# EasyEDA Pro project ProProject_基于CW32单片机的无刷电机控制器_2024-04-30.epro, schematic Schematic1

## Sheets
1 P1: Create Date: 2024-02-22; Page Name: P1; Project Name: 基于CW32单片机的伺服电机控制器; Schematic Name: Schematic1; Update Date: 2024-04-02; Company: 嘉立创EDA; Page Size: A4; Version: V1.0
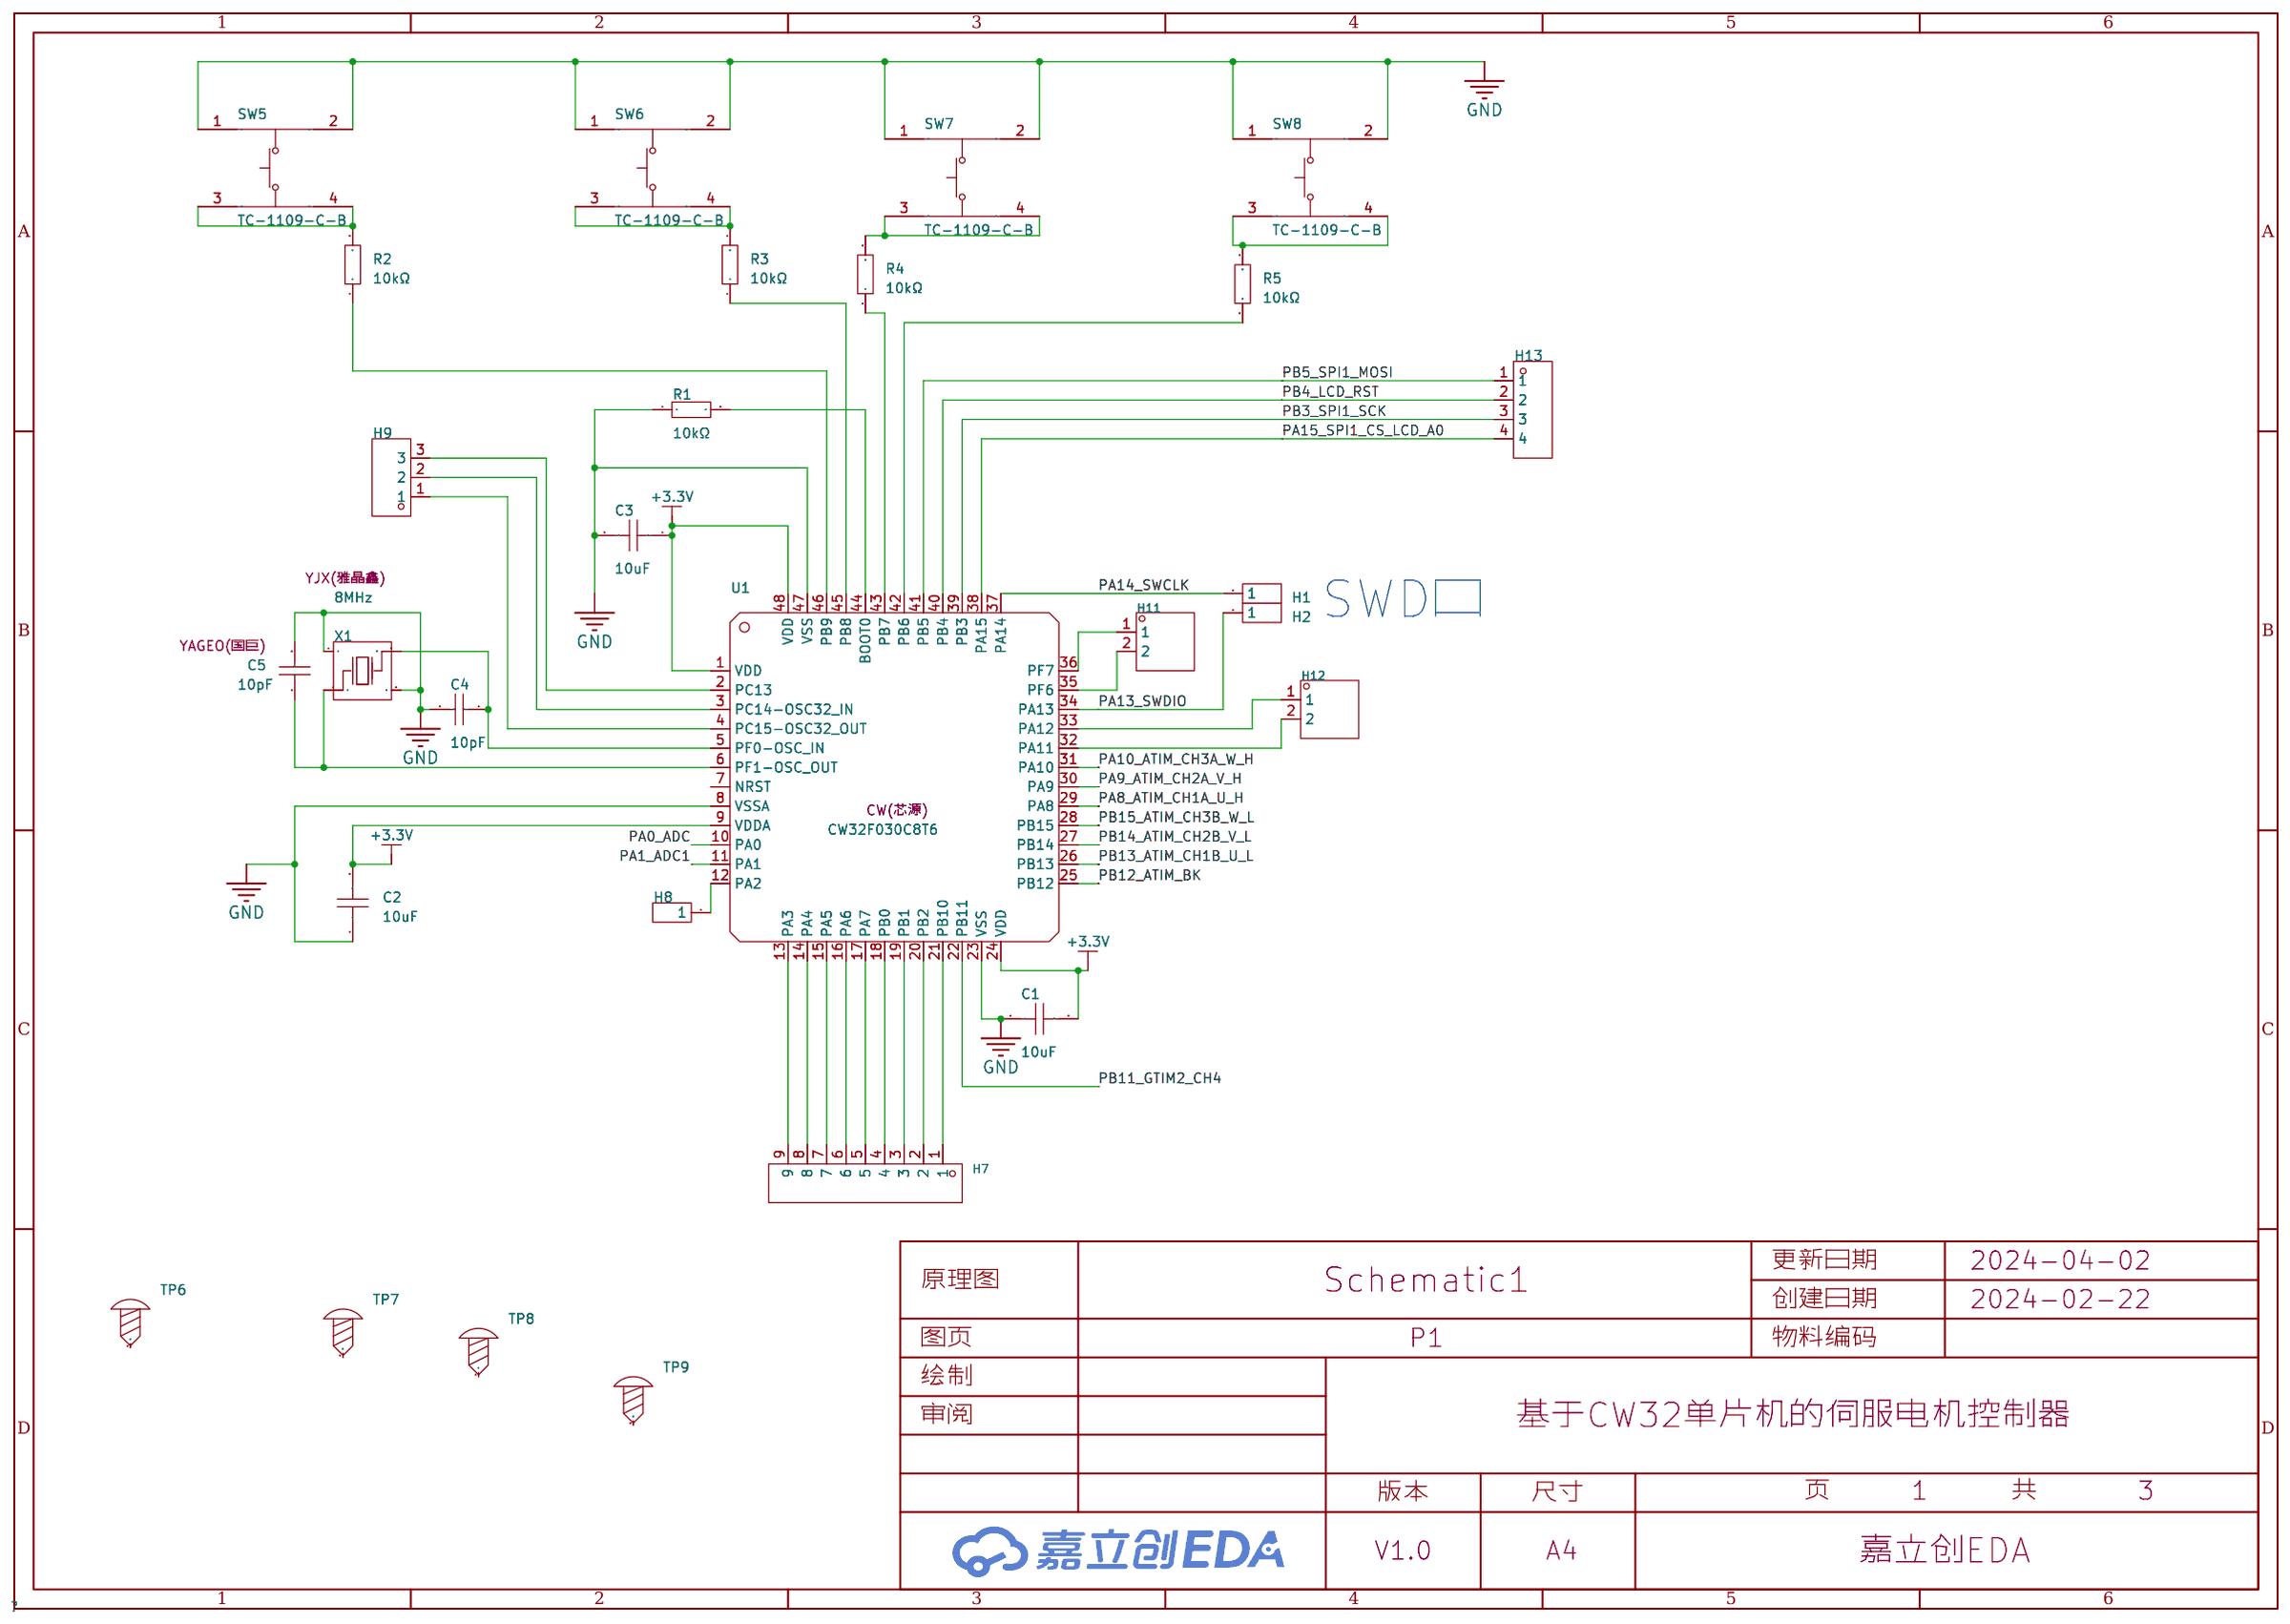
[diagram p0: P1]
2 P2: Create Date: 2024-03-02; Page Name: P2; Update Date: 2024-04-03
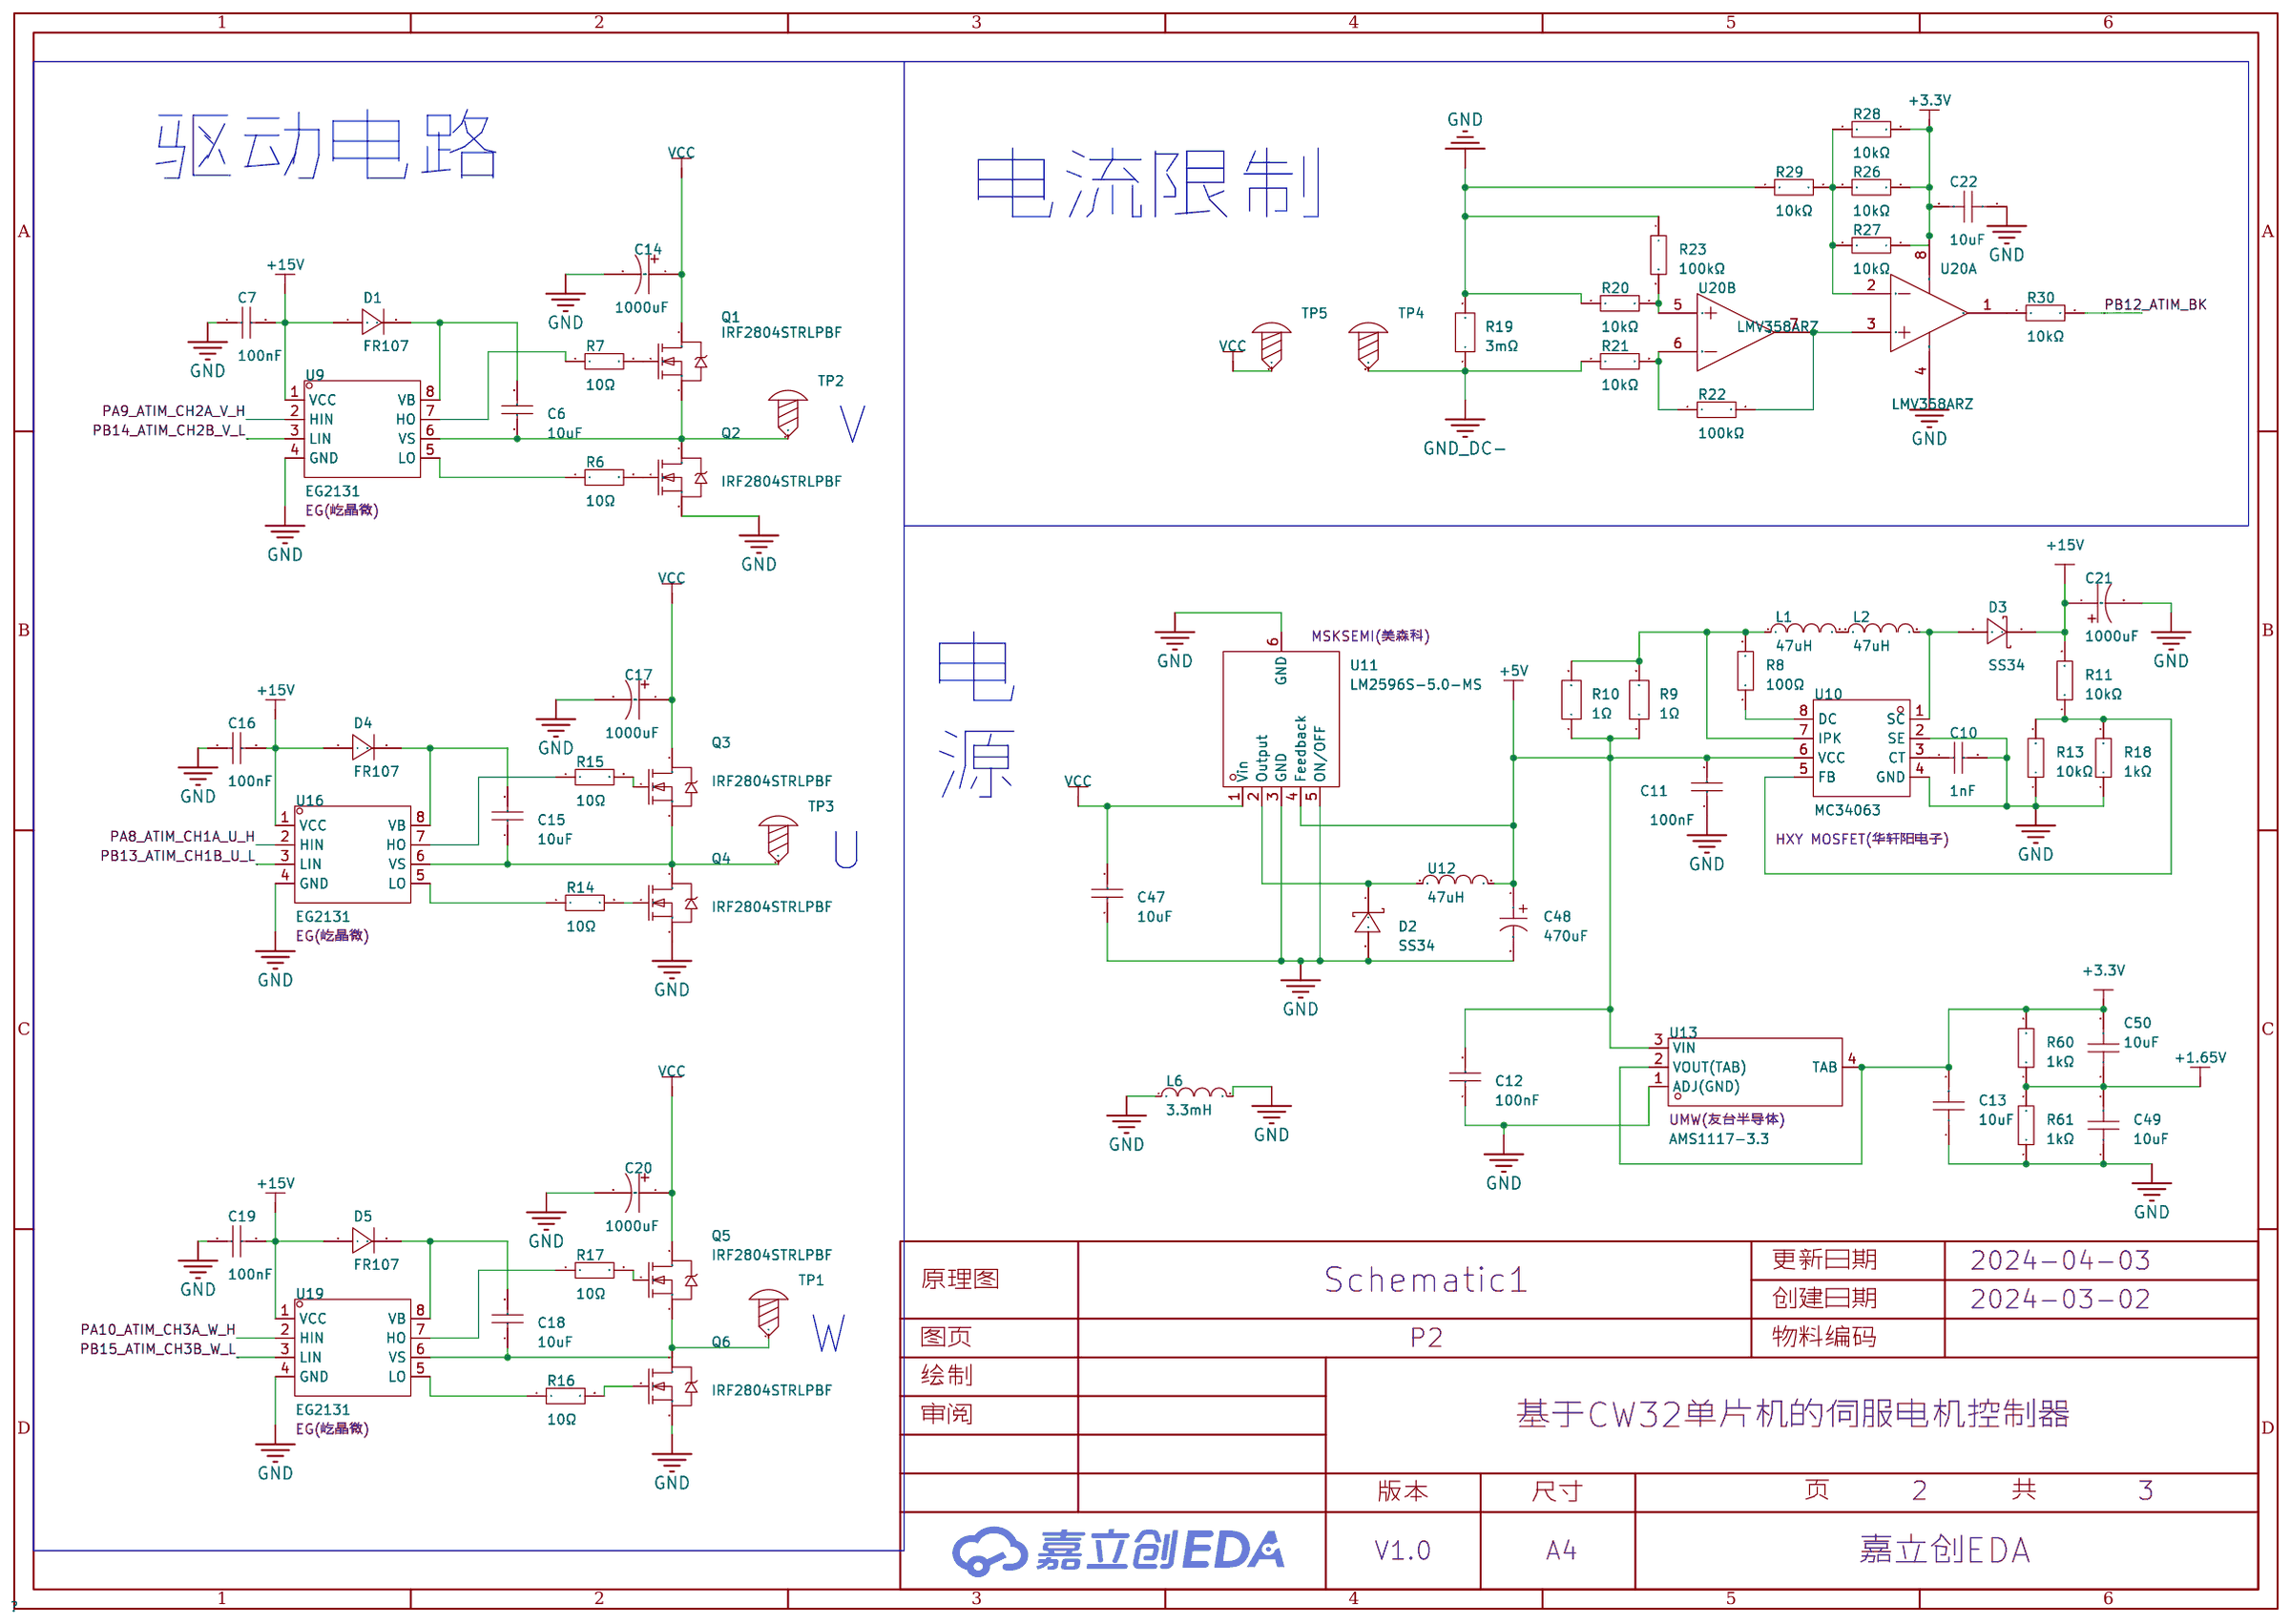
[diagram p1: P2]
3 P3: Create Date: 2024-04-02; Page Name: P3
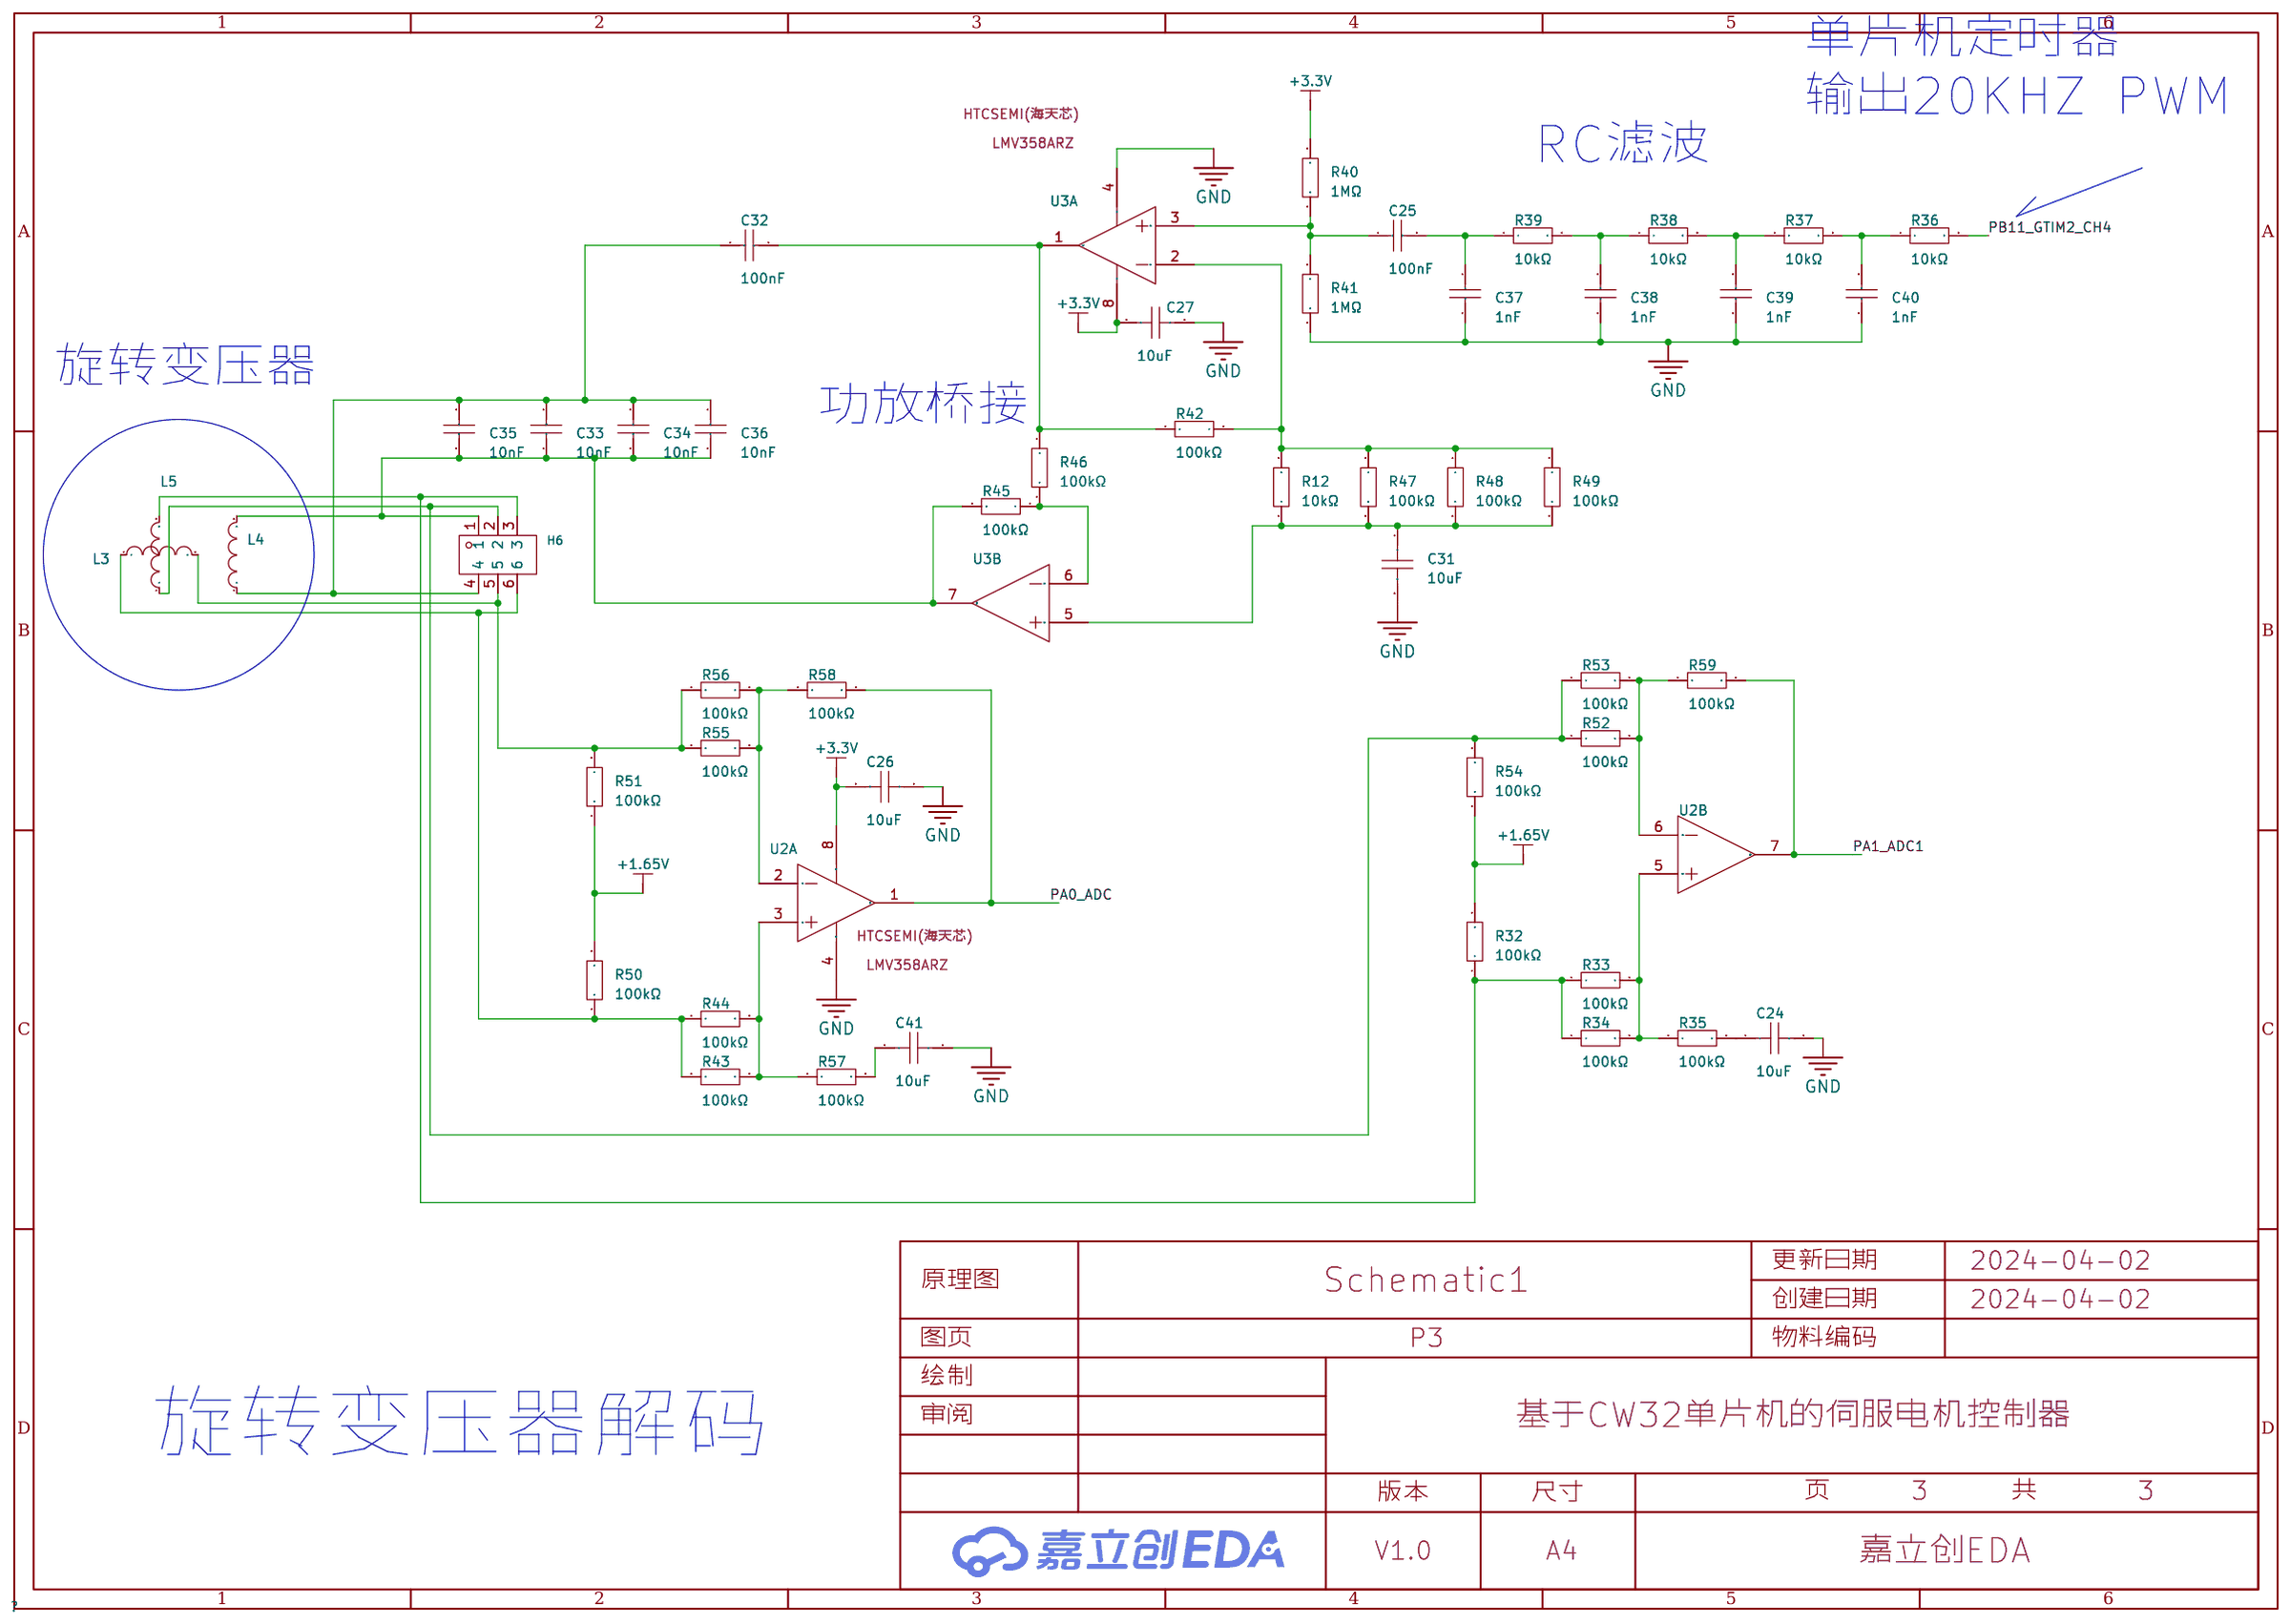
[diagram p2: P3]

## Parts
sheet P1
C1  10uF  [C0603]
C2  10uF  [C0603]
C3  10uF  [C0603]
C4  10pF  [C0603]
C5  10pF  [C0603]
H1  -  [HDR-TH_1P-V-M_XKB_X4611WV-01I-C28D40]
H2  -  [HDR-TH_1P-V-M_XKB_X4611WV-01I-C28D40]
H7  -  [HDR-TH_9P-P2.54-V-M]
H8  -  [HDR-TH_1P-V-M_XKB_X4611WV-01I-C28D40]
H9  -  [HDR-TH_3P-P2.54-V-M]
H11  -  [HDR-TH_2P-P2.54-V-M-1]
H12  -  [HDR-TH_2P-P2.54-V-M-1]
H13  -  [HDR-TH_4P-P2.54-V-M]
R1  10kΩ  [R0603]
R2  10kΩ  [R0603]
R3  10kΩ  [R0603]
R4  10kΩ  [R0603]
R5  10kΩ  [R0603]
SW5  TC-1109-C-B  [KEY-TH_4P-L4.5-W4.5-P3.00-LS5.8]
SW6  TC-1109-C-B  [KEY-TH_4P-L4.5-W4.5-P3.00-LS5.8]
SW7  TC-1109-C-B  [KEY-TH_4P-L4.5-W4.5-P3.00-LS5.8]
SW8  TC-1109-C-B  [KEY-TH_4P-L4.5-W4.5-P3.00-LS5.8]
TP6  -  [M3螺丝]
TP7  -  [M3螺丝]
TP8  -  [M3螺丝]
TP9  -  [M3螺丝]
U1  CW32F030C8T6  [LQFP-48_L7.0-W7.0-P0.50-LS9.0-TL]
X1  8MHz  [OSC-SMD_4P-L3.2-W2.5-BL]
sheet P2
C6  10uF  [C1206]
C7  100nF  [C0603]
C10  1nF  [C0603]
C11  100nF  [C0603]
C12  100nF  [C0603]
C13  10uF  [C0603]
C14  1000uF  [CAP-TH_BD10.0-P5.00-D1.0-FD]
C15  10uF  [C1206]
C16  100nF  [C0603]
C17  1000uF  [CAP-TH_BD10.0-P5.00-D1.0-FD]
C18  10uF  [C1206]
C19  100nF  [C0603]
C20  1000uF  [CAP-TH_BD10.0-P5.00-D1.0-FD]
C21  1000uF  [CAP-TH_BD10.0-P5.00-D1.0-FD]
C22  10uF  [C0603]
C47  10uF  [C1206]
C48  470uF  [CAP-TH_BD10.0-P5.00-D0.6-FD]
C49  10uF  [C0603]
C50  10uF  [C0603]
D1  FR107  [DO-41_BD2.4-L4.7-P8.70-D0.9-FD]
D2  SS34  [SMA_L4.3-W2.6-LS5.2-RD]
D3  SS34  [SMA_L4.3-W2.6-LS5.2-RD]
D4  FR107  [DO-41_BD2.4-L4.7-P8.70-D0.9-FD]
D5  FR107  [DO-41_BD2.4-L4.7-P8.70-D0.9-FD]
L1  47uH  [IND-SMD_L4.5-W4.0_SLF0403]
L2  47uH  [IND-SMD_L4.5-W4.0_SLF0403]
L6  3.3mH  [IND-TH_BD5.0-L10.5-P14.50-D0.6]
Q1  IRF2804STRLPBF  [D2PAK_L10.0-W9.0-P2.54-LS15.0-BR]
Q2  IRF2804STRLPBF  [D2PAK_L10.0-W9.0-P2.54-LS15.0-BR]
Q3  IRF2804STRLPBF  [D2PAK_L10.0-W9.0-P2.54-LS15.0-BR]
Q4  IRF2804STRLPBF  [D2PAK_L10.0-W9.0-P2.54-LS15.0-BR]
Q5  IRF2804STRLPBF  [D2PAK_L10.0-W9.0-P2.54-LS15.0-BR]
Q6  IRF2804STRLPBF  [D2PAK_L10.0-W9.0-P2.54-LS15.0-BR]
R6  10Ω  [R0603]
R7  10Ω  [R0603]
R8  100Ω  [R0603]
R9  1Ω  [R0603]
R10  1Ω  [R0603]
R11  10kΩ  [R0603]
R13  10kΩ  [R0603]
R14  10Ω  [R0603]
R15  10Ω  [R0603]
R16  10Ω  [R0603]
R17  10Ω  [R0603]
R18  1kΩ  [R0603]
R19  3mΩ  [R5930]
R20  10kΩ  [R0603]
R21  10kΩ  [R0603]
R22  100kΩ  [R0603]
R23  100kΩ  [R0603]
R26  10kΩ  [R0603]
R27  10kΩ  [R0603]
R28  10kΩ  [R0603]
R29  10kΩ  [R0603]
R30  10kΩ  [R0603]
R60  1kΩ  [R0603]
R61  1kΩ  [R0603]
TP1  -  [M4螺丝]
TP2  -  [M4螺丝]
TP3  -  [M4螺丝]
TP4  -  [M4螺丝]
TP5  -  [M4螺丝]
U9  EG2131  [SOIC-8_L5.0-W4.0-P1.27-LS6.0-BL]
U10  MC34063  [SOIC-8_L5.0-W4.0-P1.27-LS6.0-BL]
U11  LM2596S-5.0-MS  [TO-263-5_L10.0-W8.4-P1.70-LS15.3-BR]
U12  47uH  [IND-SMD_L7.1-W6.6]
U13  AMS1117-3.3  [SOT-223-4_L6.5-W3.5-P2.30-LS7.0-BR]
U16  EG2131  [SOIC-8_L5.0-W4.0-P1.27-LS6.0-BL]
U19  EG2131  [SOIC-8_L5.0-W4.0-P1.27-LS6.0-BL]
U20  LMV358ARZ  [SOP-8_L4.9-W3.9-P1.27-LS6.0-BL]  (sections 1,2)
sheet P3
C24  10uF  [C0603]
C25  100nF  [C0603]
C26  10uF  [C0603]
C27  10uF  [C0603]
C31  10uF  [C0603]
C32  100nF  [C0603]
C33  10nF  [C0603]
C34  10nF  [C0603]
C35  10nF  [C0603]
C36  10nF  [C0603]
C37  1nF  [C0603]
C38  1nF  [C0603]
C39  1nF  [C0603]
C40  1nF  [C0603]
C41  10uF  [C0603]
H6  PZ254-2-03-Z-8.5  [HDR-TH_6P-P2.54-V-M-R2-C3-S2.54]
L3  10uH  [L1206]
L4  6.3uH  [L1206]
L5  10uH  [L1206]
R12  10kΩ  [R0603]
R32  100kΩ  [R0603]
R33  100kΩ  [R0603]
R34  100kΩ  [R0603]
R35  100kΩ  [R0603]
R36  10kΩ  [R0603]
R37  10kΩ  [R0603]
R38  10kΩ  [R0603]
R39  10kΩ  [R0603]
R40  1MΩ  [R0603]
R41  1MΩ  [R0603]
R42  100kΩ  [R0603]
R43  100kΩ  [R0603]
R44  100kΩ  [R0603]
R45  100kΩ  [R0603]
R46  100kΩ  [R0603]
R47  100kΩ  [R0603]
R48  100kΩ  [R0603]
R49  100kΩ  [R0603]
R50  100kΩ  [R0603]
R51  100kΩ  [R0603]
R52  100kΩ  [R0603]
R53  100kΩ  [R0603]
R54  100kΩ  [R0603]
R55  100kΩ  [R0603]
R56  100kΩ  [R0603]
R57  100kΩ  [R0603]
R58  100kΩ  [R0603]
R59  100kΩ  [R0603]
U2  -  [SOP-8_L4.9-W3.9-P1.27-LS6.0-BL]  (sections 1,2)
U3  -  [SOP-8_L4.9-W3.9-P1.27-LS6.0-BL]  (sections 1,2)

## Library data of the parts
C1-C3 C13 C22 C24 C26 C27 C31 C41 C49 C50 = CL10A106KP8NNNC: 容值:10uF;精度:±10%;额定电压:10V;材质(温度系数):X5R;; LCSC Part Name: 10uF ±10% 10V; Supplier Part: C19702; Manufacturer: SAMSUNG(三星); Supplier Footprint: 0603; JLCPCB Part Class: 基础库; Datasheet: https://atta.szlcsc.com/upload/public/pdf/source/20160218/1457707763339.pdf; Supplier: LCSC; Tolerance: ±10%; Voltage Rated: 10V; Temperature Coefficient: X5R
C4 C5 = CC0603JRNPO9BN100: 容值:10pF;精度:±5%;额定电压:50V;材质(温度系数):NP0;; LCSC Part Name: 10pF ±5% 50V; Supplier Part: C106245; Manufacturer: YAGEO(国巨); Supplier Footprint: 0603; JLCPCB Part Class: 扩展库; Datasheet: https://atta.szlcsc.com/upload/public/pdf/source/20170505/1493957838062.pdf; Supplier: LCSC; Tolerance: ±5%; Voltage Rated: 50V; Temperature Coefficient: NP0
H1 H2 H8 = HDR-M_2.54_1x1P: Supplier Part: C81276; Supplier Footprint: 插件; JLCPCB Part Class: Extended Part
H7 = HDR-M_2.54-1x9P: Supplier Part: C492408; Supplier Footprint: 插件
H9 = HDR-M_2.54_1x3P: Supplier Part: C2937625; Supplier Footprint: 插件
H11 H12 = HDR-M_2.54_1x2P: Supplier Part: C124375; Supplier Footprint: 插件
H13 = HDR-M_2.54_1x4P: Supplier Part: C492403; Supplier Footprint: 插件
R1-R5 R11-R13 R20 R21 R26-R30 R36-R39 = RC0603FR-0710KL: 电阻类型:厚膜电阻;阻值:10kΩ;精度:±1%;功率:100mW;最大工作电压:75V;温度系数:±100ppm/℃;; LCSC Part Name: 厚膜电阻 10kΩ ±1% 100mW; Supplier Part: C98220; Manufacturer: YAGEO(国巨); Supplier Footprint: 0603; JLCPCB Part Class: 扩展库; Datasheet: https://atta.szlcsc.com/upload/public/pdf/source/20180927/C295883_E8D83085EA81BD7DE0B2B681138C15EE.pdf; Supplier: LCSC; Type: 厚膜电阻; Tolerance: ±1%; Power(Watts): 100mW; Overload Voltage (Max): 75V; Temperature Coefficient: ±100ppm/℃; Operating Temperature Range: -55℃~+155℃
SW5-SW8 = TC-1109-C-B: 电路结构:单刀单掷;按钮形状:圆形按钮;作用力:260gf;安装方式:直插;开关长度:4.5mm;开关宽度:4.5mm;开关高度:4.3mm;带支架:不带;触点电流:50mA;额定电压(DC):12V;绝缘电阻:-;带灯:无;机械寿命:10万次;; LCSC Part Name: 4.5*4.5*4.3mm 直插 轻触开关; Supplier Part: C381028; Manufacturer: XKB Connectivity(中国星坤); Supplier Footprint: 插件; JLCPCB Part Class: 扩展库; Datasheet: https://atta.szlcsc.com/upload/public/pdf/source/20200227/C381029_60190E4BA5E8CCEE2F9455ADEE779639.pdf; Supplier: LCSC; Circuit: 单刀单掷; Actuator Style: 圆形按钮; Operating Force: 260gf; Mounting Style: 直插; Switch Length: 4.5mm; Switch Width: 4.5mm; Switch Height: 4.3mm; Strike Gundam: 不带; Contact Current: 50mA; Voltage Rating (DC): 12V; Actuator/Cap Color: 黑色; With Lamp: 无; Pin Style: PC引脚; Mechanical Life: 10万次; Operating Temperature: -30℃~+85℃
TP6-TP9 = M3螺丝: Supplier Footprint: 插件
U1 = CW32F030C8T6_C3019113: CPU内核:ARM-M系列;RAM总容量:8KB;GPIO端口数量:39;工作电压范围:1.65V~5.5V;CPU最大主频:64MHz;程序存储器类型:-;; Supplier Part: C3019113; Manufacturer: CW(芯源); Supplier Footprint: LQFP-48(7x7); JLCPCB Part Class: 扩展库; Datasheet: https://atta.szlcsc.com/upload/public/pdf/source/20220516/D60F5E1023A73FFF550D4A77416DDFBC.pdf; Supplier: LCSC; CPU Core: ARM-M系列; RAM Size: 8KB; GPIO Ports Number: 39; Operating Voltage Range: 1.65V~5.5V; CPU Maximum Speed: 64MHz; Operating Temperature Range: -40℃~+105℃; ADC (Bit): 12bit; 16Bit Timer: 8; UART/USART: 3; I2C: 2; SPI: 2; Internal Comparator: 有; Peripheral/Function: 片载温度传感器；DMA；看门狗；低电压检测；CRC校验; Watchdog: 有; Low-Voltage Detect: 有; Direct Memory Access: 有
X1 = TAXM8M4RDBCCT2T: 晶振类型:贴片晶振;频率:8MHz;常温频差:±10ppm;外接负载电容:10pF;频率稳定度(全温):±15ppm;; LCSC Part Name: 8MHz ±10ppm 10pF; Supplier Part: C400090; Manufacturer: YJX(雅晶鑫); Supplier Footprint: SMD3225-4P; JLCPCB Part Class: 扩展库; Datasheet: https://atta.szlcsc.com/upload/public/pdf/source/20190626/C400090_CF95B89E745AFE4EF2E392EF8AC009D6.pdf; Supplier: LCSC; Crystal Type: 贴片晶振; Normal temperature Frequency Tolerance: ±10ppm; External load capacitor: 10pF; Frequency Stability(Full temperature range): ±15ppm; Equivalent Series Resistance (ESR): 250Ω; Operating Temperature: -40℃~+85℃
C6 C15 C18 C47 = CL31A106KBHNNNE: 容值:10uF;精度:±10%;额定电压:50V;材质(温度系数):X5R;; LCSC Part Name: 10uF ±10% 50V; Supplier Part: C13585; Manufacturer: SAMSUNG(三星); Supplier Footprint: 1206; JLCPCB Part Class: 基础库; Datasheet: https://atta.szlcsc.com/upload/public/pdf/source/20160218/1457707763339.pdf; Supplier: LCSC; Tolerance: ±10%; Voltage Rated: 50V; Temperature Coefficient: X5R
C7 C11 C12 C16 C19 C25 C32 = 0603B104K500NT: 容值:100nF;精度:±10%;额定电压:50V;材质(温度系数):X7R;; LCSC Part Name: 100nF ±10% 50V; Supplier Part: C30926; Manufacturer: FH(风华); Supplier Footprint: 0603; JLCPCB Part Class: 扩展库; Datasheet: https://atta.szlcsc.com/upload/public/pdf/source/20200305/C486355_26A10D38EF8C2A5C37091D0039909270.pdf; Supplier: LCSC; Tolerance: ±10%; Voltage Rated: 50V; Temperature Coefficient: X7R
C10 C37-C40 = CC0603JRNPO9BN102: 容值:1nF;精度:±5%;额定电压:50V;材质(温度系数):NP0;; LCSC Part Name: 1nF ±5% 50V; Supplier Part: C106246; Manufacturer: YAGEO(国巨); Supplier Footprint: 0603; JLCPCB Part Class: 扩展库; Datasheet: https://atta.szlcsc.com/upload/public/pdf/source/20170505/1493957838062.pdf; Supplier: LCSC; Tolerance: ±5%; Voltage Rated: 50V; Temperature Coefficient: NP0
C14 C17 C20 C21 = ERR1VM102G20OT: 容值:1000uF;精度:±20%;额定电压:35V;; LCSC Part Name: 1000uF ±20% 35V; Supplier Part: C398835; Manufacturer: AISHI(艾华集团); Supplier Footprint: 插件,D10xL20mm; JLCPCB Part Class: 扩展库; Datasheet: https://atta.szlcsc.com/upload/public/pdf/source/20190702/C401591_1676EF45BC9A88BD1D6B22BBAE3913C7.pdf; Supplier: LCSC; Tolerance: ±20%; Rated Voltage: 35V; Lead Spacing: 5mm; φD: 10mm; L: 20mm; Lifetime @ Temp: 2000hrs@105℃
C48 = 35V470uF CD110: 容值:470uF;精度:±20%;额定电压:35V;; LCSC Part Name: 470uF ±20% 35V; Supplier Part: C2960394; Manufacturer: HRK(鸿瑞凯电子); Supplier Footprint: 插件,D10xL17mm; JLCPCB Part Class: 扩展库; Datasheet: https://atta.szlcsc.com/upload/public/pdf/source/20220224/D53946E56E2AF613ECCDBE172010D613.pdf; Supplier: LCSC; Tolerance: ±20%; Rated Voltage: 35V; Lead Spacing: 5mm; φD: 10mm; L: 17mm; Operating Temperature: -40℃~+105℃
D1 D4 D5 = FR107_C35253: 二极管配置:-;正向压降(Vf):1.3V@1A;直流反向耐压(Vr):1kV;平均整流电流(Io):1A;反向恢复时间(trr):500ns;; LCSC Part Name: 电压:1kV 电流:1A; Supplier Part: C35253; Manufacturer: MDD; Supplier Footprint: DO-41; JLCPCB Part Class: 扩展库; Datasheet: https://atta.szlcsc.com/upload/public/pdf/source/20230823/95EC475391AED3EACDBE81DA6E12F611.pdf; Supplier: LCSC; Forward Voltage (Vf@If): 1.3V@1A; Reverse Voltage (Vr): 1kV; Average Rectified Current (Io): 1A; Reverse Leakage Current: 5uA@1kV; Reverse Recovery Time (trr): 500ns; Operating Temperature: -65℃~+150℃@(Tj)
D2 D3 = SS34_C8678: 二极管配置:独立式;正向压降(Vf):550mV@3A;直流反向耐压(Vr):40V;平均整流电流(Io):3A;; LCSC Part Name: 电压:40V 电流:3A; Supplier Part: C8678; Manufacturer: MDD; Supplier Footprint: SMA(DO-214AC); JLCPCB Part Class: 基础库; Datasheet: https://atta.szlcsc.com/upload/public/pdf/source/20230314/A80AE34493C69B89E2F4B1712F433538.pdf; Supplier: LCSC; Diode Configuration: 独立式; Forward Voltage (Vf@If): 550mV@3A; Reverse Voltage (Vr): 40V; Average Rectified Current (Io): 3A; Reverse Leakage Current (Ir): 500uA@40V
L1 L2 = SLF0403-470KTT: 电感值:47uH;精度:±10%;额定电流:540mA;; LCSC Part Name: 47uH ±10%; Supplier Part: C182152; Manufacturer: Sunltech(韩国顺磁); Supplier Footprint: SMD; JLCPCB Part Class: 扩展库; Datasheet: https://atta.szlcsc.com/upload/public/pdf/source/20180622/C182201_C2E2778B6752CF513C201C52BBFBA88C.pdf; Supplier: LCSC; Tolerance: ±10%; Rated Current: 540mA; DC Resistance (DCR): 844mΩ
L6 = CKL0510*3.3mH/K-A T: 电感值:3.3mH;精度:±10%;额定电流:62mA;类型:色环电感;Q值:50@0.252MHz;; LCSC Part Name: 色环电感 3.3mH ±10%; Supplier Part: C354678; Manufacturer: CENKER(岑科); Supplier Footprint: 插件,D5xL11mm; JLCPCB Part Class: 扩展库; Datasheet: https://atta.szlcsc.com/upload/public/pdf/source/20190315/C354679_C0281614A754FCB6C690AF872C63A006.pdf; Supplier: LCSC; Tolerance: ±10%; Rated Current: 62mA; DC Resistance: 50Ω; Type: 色环电感; Q @ Frequency: 50@0.252MHz; Frequency - Self Resonant: 700kHz
Q1-Q6 = IRF2804STRLPBF: 类型:N沟道;漏源电压(Vdss):40V;连续漏极电流(Id):75A;功率(Pd):300W;导通电阻(RDS(on)@Vgs,Id):2mΩ@10V,75A;阈值电压(Vgs(th)@Id):4V@250uA;; LCSC Part Name: N沟道 耐压:40V 电流:75A; Supplier Part: C459951; Manufacturer: Infineon(英飞凌); Supplier Footprint: D2PAK; JLCPCB Part Class: 扩展库; Datasheet: https://atta.szlcsc.com/upload/public/pdf/source/20191122/C459951_C5063D70B8F4262A32A22B385B43E8D0.pdf; Supplier: LCSC; Type: N沟道; Drain Source Voltage (Vdss): 40V; Continuous Drain Current (Id): 75A; Power Dissipation (Pd): 300W; Drain Source On Resistance (RDS(on)@Vgs,Id): 2mΩ@10V,75A; Gate Threshold Voltage (Vgs(th)@Id): 4V@250uA; Total Gate Charge (Qg@Vgs): 240nC@10V; Input Capacitance (Ciss@Vds): 6.45nF@25V; Operating Temperature: -55℃~+175℃@(Tj)
R6 R7 R14-R17 = 0603WAF100JT5E: 电阻类型:厚膜电阻;阻值:10Ω;精度:±1%;功率:100mW;最大工作电压:75V;温度系数:±400ppm/℃;; LCSC Part Name: 10Ω ±1% 100mW 厚膜电阻; Supplier Part: C22859; Manufacturer: UNI-ROYAL(厚声); Supplier Footprint: 0603; JLCPCB Part Class: 基础库; Datasheet: https://atta.szlcsc.com/upload/public/pdf/source/20200306/C422600_1E6D84923E4A46A82E41ADD87F860B5C.pdf; Supplier: LCSC; Type: 厚膜电阻; Tolerance: ±1%; Power(Watts): 100mW; Overload Voltage (Max): 75V; Temperature Coefficient: ±400ppm/℃; Operating Temperature Range: -55℃~+155℃
R8 = RC0603FR-07100RL: 电阻类型:厚膜电阻;阻值:100Ω;精度:±1%;功率:100mW;最大工作电压:75V;温度系数:±100ppm/℃;; LCSC Part Name: 厚膜电阻 100Ω ±1% 100mW; Supplier Part: C105588; Manufacturer: YAGEO(国巨); Supplier Footprint: 0603; JLCPCB Part Class: 扩展库; Datasheet: https://atta.szlcsc.com/upload/public/pdf/source/20180316/70C0E2BDAE7FCC62C531A5A58D202EE1.pdf; Supplier: LCSC; Type: 厚膜电阻; Tolerance: ±1%; Power(Watts): 100mW; Overload Voltage (Max): 75V; Temperature Coefficient: ±100ppm/℃; Operating Temperature Range: -55℃~+155℃
R9 R10 = SCR0603F1R: 电阻类型:厚膜电阻;阻值:1Ω;精度:±1%;功率:100mW;最大工作电压:75V;; LCSC Part Name: 1Ω ±1%; Supplier Part: C3016186; Manufacturer: VO(翔胜); Supplier Footprint: 0603; JLCPCB Part Class: 扩展库; Datasheet: https://atta.szlcsc.com/upload/public/pdf/source/20220513/247AF9639BA21CF93567DC289CCC6A22.pdf; Supplier: LCSC; Type: 厚膜电阻; Tolerance: ±1%; Power(Watts): 100mW; Overload Voltage (Max): 75V; Operating Temperature Range: -55℃~+155℃
R18 R60 R61 = RC0603FR-071KL: 电阻类型:厚膜电阻;阻值:1kΩ;精度:±1%;功率:100mW;最大工作电压:75V;温度系数:±100ppm/℃;; LCSC Part Name: 厚膜电阻 1kΩ ±1% 100mW; Supplier Part: C22548; Manufacturer: YAGEO(国巨); Supplier Footprint: 0603; JLCPCB Part Class: 扩展库; Datasheet: https://atta.szlcsc.com/upload/public/pdf/source/20180316/70C0E2BDAE7FCC62C531A5A58D202EE1.pdf; Supplier: LCSC; Type: 厚膜电阻; Tolerance: ±1%; Power(Watts): 100mW; Overload Voltage (Max): 75V; Temperature Coefficient: ±100ppm/℃; Operating Temperature Range: -55℃~+155℃
R19 = EBWS5930F3L00K9L: 电阻类型:采样电阻;阻值:3mΩ;精度:±1%;额定压降:-;功率:7W;温度系数:±100ppm/℃;安装方式:贴片;; LCSC Part Name: 3mΩ ±1% 7W; Supplier Part: C494596; Manufacturer: RESI(开步睿思）; Supplier Footprint: 5930; JLCPCB Part Class: 扩展库; Datasheet: https://atta.szlcsc.com/upload/public/pdf/source/20200428/C494572_1906A236A7F16EA247B6F3B5657545A5.pdf; Supplier: LCSC; Type: 采样电阻; Tolerance: ±1%; Power(Watts): 7W; Temperature Coefficient: ±100ppm/℃; Mounting Sytle: 贴片
R22 R23 R32-R35 R42-R59 = RC0603FR-07100KL: 电阻类型:厚膜电阻;阻值:100kΩ;精度:±1%;功率:100mW;最大工作电压:75V;温度系数:±100ppm/℃;; LCSC Part Name: 厚膜电阻 100kΩ ±1% 100mW; Supplier Part: C14675; Manufacturer: YAGEO(国巨); Supplier Footprint: 0603; JLCPCB Part Class: 扩展库; Datasheet: https://atta.szlcsc.com/upload/public/pdf/source/20140324/1457707028752.pdf; Supplier: LCSC; Type: 厚膜电阻; Tolerance: ±1%; Power(Watts): 100mW; Overload Voltage (Max): 75V; Temperature Coefficient: ±100ppm/℃; Operating Temperature Range: -55℃~+155℃
TP1-TP5 = M4螺丝: Supplier Footprint: 插件
U9 U16 U19 = EG2131: Supplier Part: C193777; Manufacturer: EG(屹晶微); Supplier Footprint: SOIC-8; JLCPCB Part Class: 扩展库; Datasheet: https://atta.szlcsc.com/upload/public/pdf/source/20180528/C193777_0A452F93B99FD4EB2A9D54E9055DABCE.pdf; Supplier: LCSC
U10 = MC34063_C5349988: 功能类型:升降压型;输出类型:可调;输入电压:3V~40V;输出电压:1.25V~40V;输出电流(最大值):1.3A;; Supplier Part: C5349988; Manufacturer: HXY MOSFET(华轩阳电子); Supplier Footprint: SOP-8; JLCPCB Part Class: 扩展库; Datasheet: https://atta.szlcsc.com/upload/public/pdf/source/20231229/D1A87F39F2F1E3F68C55B6C50423EC0B.pdf; Supplier: LCSC; Function: 升降压型; Output Type: 可调; Input Voltage: 3V~40V; Output Voltage: 1.25V~40V; Output Current (Max): 1.3A; Switching Frequency: 100kHz; Operating Temperature: 0℃~+70℃; Number of Outputs: 1; Switch tube (built-in/external): 内置
U11 = LM2596S-5.0-MS: 功能类型:降压型;输出类型:-;输入电压:7V~40V;输出电压:5V;输出电流(最大值):3A;; LCSC Part Name: Vin=7V-40V Vout=5V 3A大电流; Supplier Part: C5174628; Manufacturer: MSKSEMI(美森科); Supplier Footprint: TO-263-5L; JLCPCB Part Class: 扩展库; Datasheet: https://atta.szlcsc.com/upload/public/pdf/source/20221027/4361E163E0CC4DA461A3D8885FDCEFBB.pdf; Supplier: LCSC; Function: 降压型; Input Voltage: 7V~40V; Output Voltage: 5V; Output Current (Max): 3A; Switching Frequency: 150kHz; Synchronous Rectification: 否; Number of Outputs: 1; Topology: 降压式; Switch tube (built-in/external): 内置
U12 = APH0630T470M: 电感值:47uH;精度:±20%;额定电流:1.25A;饱和电流(Isat):1.66A;类型:一体成型电感;; LCSC Part Name: 47uH ±20% 1.66A; Supplier Part: C5349685; Manufacturer: APV(爱普微); Supplier Footprint: SMD,7x6.6mm; JLCPCB Part Class: 扩展库; Datasheet: https://atta.szlcsc.com/upload/public/pdf/source/20230920/8DF4F91CA8787177DE496A10F73889DA.pdf; Supplier: LCSC; Tolerance: ±20%; Rated Current: 1.25A; Saturation Current (Isat): 1.66A; DC Resistance (DCR): 385mΩ; Type: 一体成型电感
U13 = AMS1117-3.3_C347222: 输出类型:固定;最大输入电压:12V;输出电压:3.3V;最大输出电流:1A;电源纹波抑制比(PSRR):60dB@(120Hz);输出极性:正极;; LCSC Part Name: 输出:3.3V 电流:1A 耐压:12V; Supplier Part: C347222; Manufacturer: UMW(友台半导体); Supplier Footprint: SOT-223; JLCPCB Part Class: 扩展库; Datasheet: https://atta.szlcsc.com/upload/public/pdf/source/20231109/155D79A26D9DB04352555A58D5969DC8.pdf; Supplier: LCSC; Output Type: 固定; Maximum Input Voltage: 12V; Output Voltage: 3.3V; MAX Output Current: 1A; Power Supply Rejection Ratio (PSRR): 60dB@(120Hz); Dropout Voltage: 1.3V@(1A); Output Polarity: 正极; Number of Outputs: 1
U2 U3 U20 = LMV358ARZ: 放大器数:双路;; Supplier Part: C2928823; Manufacturer: HTCSEMI(海天芯); Supplier Footprint: SOP-8; JLCPCB Part Class: 扩展库; Datasheet: https://atta.szlcsc.com/upload/public/pdf/source/20220114/2D4B849A76DE33264688A93B3A90A0F8.pdf; Supplier: LCSC; Number of Circuits: 双路
C33-C36 = CC0603KRX7R9BB103: 容值:10nF;精度:±10%;额定电压:50V;材质(温度系数):X7R;; LCSC Part Name: 10nF ±10% 50V; Supplier Part: C100042; Manufacturer: YAGEO(国巨); Supplier Footprint: 0603; JLCPCB Part Class: 扩展库; Datasheet: https://atta.szlcsc.com/upload/public/pdf/source/20181008/C309510_22F155564471FAF6A489F7D68F34234E.pdf; Supplier: LCSC; Tolerance: ±10%; Voltage Rated: 50V; Temperature Coefficient: X7R
H6 = PZ254-2-03-Z-8.5_C2894964: 排数:双排;总PIN位数:6;间距:2.54mm;插针结构:2x3P;行距:2.54mm;安装类型:直插;圆针/方针:方针;额定电流:3A;额定电压:-;配合针长度:6mm;塑高:2.5mm;端接针长度:3mm;触头材质:-;工作温度范围:-40℃~+105℃;颜色:黑色;; Supplier: LCSC; Supplier Part: C2894964; Manufacturer: HCTL(华灿天禄); JLCPCB Part Class: 扩展库; LCSC Part Name: 2.54mm 2x3P 直插 方针; Supplier Footprint: 直插,P=2.54mm; Number of Rows: 双排; Number of Pins: 6; Pitch: 2.54mm; Pin Structure: 2x3P; Row Spacing: 2.54mm; Mounting Type: 直插; Circluar Pins/Square Pins: 方针; Current Rating (Max): 3A; Length of Mating Pin: 6mm; Insulation Height: 2.5mm; Length of End Connection Pin: 3mm; Operating Temperature Range: -40℃~+105℃; Color: 黑色
L3-L5 = L_1206
R40 R41 = 0603WAF1004T5E: 电阻类型:厚膜电阻;阻值:1MΩ;精度:±1%;功率:100mW;; LCSC Part Name: 1MΩ±1%100mW; Supplier Part: C22935; Manufacturer: UNI-ROYAL(厚声); Supplier Footprint: 0603; JLCPCB Part Class: BasicPart; Datasheet: https://atta.szlcsc.com/upload/public/pdf/source/20200306/C422600_1E6D84923E4A46A82E41ADD87F860B5C.pdf; Supplier: LCSC; Type: 厚膜电阻; Tolerance: ±1%; Power(Watts): 100mW; Temperature Coefficient: ±100ppm/℃; Overload Voltage (Max): 75V; Operating Temperature Range: -55℃~+155℃

## Nets
+1.65V: C49.2 C50.1 R32.2 R50.2 R51.1 R54.1 R60.1 R61.2
+3.3V: C1.2 C2.2 C3.1 C13.2 C22.2 C26.2 C27.2 C50.2 R26.2 R27.2 R28.2 R40.2 R60.2 U1.1(VDD) U1.9(VDDA) U1.24(VDD) U1.48(VDD) U2.8(VCC) U3.8(VCC) U13.2(VOUT(TAB)) U13.4(TAB) U20.8(VCC)
+5V: C11.2 C12.2 C48.1 R9.1 R10.1 U10.6(VCC) U11.4(Feedback) U12.2 U13.3(VIN)
+15V: C7.2 C16.2 C19.2 C21.1 D1.1(A) D3.1(K) D4.1(A) D5.1(A) R11.2 U9.1(VCC) U16.1(VCC) U19.1(VCC)
GND: C1.1 C2.1 C3.2 C4.1 C5.2 C7.1 C10.2 C11.1 C12.1 C13.1 C14.2 C16.1 C17.2 C19.1 C20.2 C21.2 C22.1 C24.2 C26.1 C27.1 C31.2 C37.1 C38.1 C39.1 C40.1 C41.2 C47.1 C48.2 C49.1 D2.2(A) L6.1 L6.2 Q2.3(S) Q4.3(S) Q6.3(S) R1.1 R13.1 R18.1 R19.2 R20.1 R23.1 R29.1 R41.1 R61.1 SW5.1 SW5.2 SW6.1 SW6.2 SW7.1 SW7.2 SW8.1 SW8.2 U1.8(VSSA) U1.23(VSS) U1.47(VSS) U2.4(GND) U3.4(GND) U9.4(GND) U10.2(SE) U10.4(GND) U11.3(GND) U11.5(ON/OFF) U11.6(GND) U13.1(ADJ(GND)) U16.4(GND) U19.4(GND) U20.4(GND) X1.2 X1.4
GND_DC-: R19.1 R21.1 TP4.1
VCC: C14.1 C17.1 C20.1 C47.2 Q1.2(D) Q3.2(D) Q5.2(D) TP5.1 U11.1(Vin)
PA0_ADC: R58.2 U1.10(PA0) U2.1(OUT)
PA1_ADC1: R59.2 U1.11(PA1) U2.7(OUT2)
PA8_ATIM_CH1A_U_H: U1.29(PA8) U16.2(HIN)
PA9_ATIM_CH2A_V_H: U1.30(PA9) U9.2(HIN)
PA10_ATIM_CH3A_W_H: U1.31(PA10) U19.2(HIN)
PA13_SWDIO: H2.1 U1.34(PA13)
PA14_SWCLK: H1.1 U1.37(PA14)
PA15_SPI1_CS_LCD_A0: H13.4 U1.38(PA15)
PB3_SPI1_SCK: H13.3 U1.39(PB3)
PB4_LCD_RST: H13.2 U1.40(PB4)
PB5_SPI1_MOSI: H13.1 U1.41(PB5)
PB11_GTIM2_CH4: R36.2 U1.22(PB11)
PB12_ATIM_BK: R30.2 U1.25(PB12)
PB13_ATIM_CH1B_U_L: U1.26(PB13) U16.3(LIN)
PB14_ATIM_CH2B_V_L: U1.27(PB14) U9.3(LIN)
PB15_ATIM_CH3B_W_L: U1.28(PB15) U19.3(LIN)
$1N1046: C4.2 U1.5(PF0-OSC_IN) X1.3
$1N1253: C5.1 U1.6(PF1-OSC_OUT) X1.1
$1N1416: R1.2 U1.44(BOOT0)
$1N1868: R2.1 U1.46(PB9)
$1N1878: R3.1 U1.45(PB8)
$1N1882: R4.1 U1.43(PB7)
$1N1886: R5.1 U1.42(PB6)
$1N6202: H7.1 U1.21(PB10)
$1N6205: H7.2 U1.20(PB2)
$1N6208: H7.3 U1.19(PB1)
$1N6214: H7.4 U1.18(PB0)
$1N6221: H7.5 U1.17(PA7)
$1N6224: H7.6 U1.16(PA6)
$1N6227: H7.7 U1.15(PA5)
$1N6233: H7.8 U1.14(PA4)
$1N6248: H7.9 U1.13(PA3)
$1N6274: H8.1 U1.12(PA2)
$1N9606: R3.2 SW6.3 SW6.4
$1N9611: R2.2 SW5.3 SW5.4
$1N9618: R4.2 SW7.3 SW7.4
$1N9625: R5.2 SW8.3 SW8.4
$2N841: R6.1 U9.5(LO)
$2N1882: D2.1(K) U11.2(Output) U12.1
$2N2223: R8.1 U10.8(DC)
$2N2340: L1.2 L2.1
$2N2437: C10.1 U10.3(CT)
$2N2721: R11.1 R13.2 R18.2 U10.5(FB)
$2N2790: D3.2(A) L2.2 U10.1(SC)
$2N6462: Q3.1(G) R15.2
$2N6470: R14.1 U16.5(LO)
$2N6902: Q6.1(G) R16.2
$2N6903: Q5.1(G) R17.2
$2N6911: R16.1 U19.5(LO)
$2N7060: C6.1 Q1.3(S) Q2.2(D) TP2.1 U9.6(VS)
$2N7066: C15.1 Q3.3(S) Q4.2(D) TP3.1 U16.6(VS)
$2N10076: L1.1 R8.2 R9.2 R10.2 U10.7(IPK)
$2N12217: R20.2 R23.2 U20.5(IN2+)
$2N12432: R21.2 R22.1 U20.6(IN2-)
$2N12909: R22.2 U20.3(IN1+) U20.7(OUT2)
$2N13101: R26.1 R27.1 R28.1 R29.2 U20.2(IN1-)
$2N13144: R30.1 U20.1(OUT)
$2N13152: R15.1 U16.7(HO)
$2N13180: C15.2 D4.2(K) U16.8(VB)
$2N13207: R17.1 U19.7(HO)
$2N13222: C18.2 D5.2(K) U19.8(VB)
$2N13249: R7.1 U9.7(HO)
$2N13264: C6.2 D1.2(K) U9.8(VB)
$2N15080: Q1.1(G) R7.2
$2N15124: Q2.1(G) R6.2
$2N15258: Q4.1(G) R14.2
$2N15347: C18.1 Q5.3(S) Q6.2(D) TP1.1 U19.6(VS)
$3N2241: C38.2 R38.1 R39.2
$3N2242: C39.2 R37.1 R38.2
$3N2243: C40.2 R36.1 R37.2
$3N2244: C25.2 C37.2 R39.1
$3N2255: C25.1 R40.1 R41.2 U3.3(IN1+)
$3N2259: R45.1 R46.2 U3.6(IN2-)
$3N2263: C32.2 R42.1 R46.1 U3.1(OUT)
$3N2266: R55.2 R56.2 R58.1 U2.2(IN1-)
$3N2267: R43.2 R44.2 R57.1 U2.3(IN1+)
$3N2269: C41.1 R57.2
$3N2271: C24.1 R35.2
$3N2272: R52.2 R53.2 R59.1 U2.6(IN2-)
$3N2273: R33.2 R34.2 R35.1 U2.5(IN2+)
$3N2687: R12.2 R42.2 R47.1 R48.1 R49.1 U3.2(IN1-)
$3N2844: C31.1 R12.1 R47.2 R48.2 R49.2 U3.5(IN2+)
Net-(C32-1): C32.1 C33.2 C34.2 C35.2 C36.2 H6.4 L4.1
Net-(C33-1): C33.1 C34.1 C35.1 C36.1 H6.1 L4.2 R45.2 U3.7(OUT2)
Net-(H6-2): H6.2 L5.1 R52.1 R53.1 R54.2
Net-(H6-3): H6.3 L5.2 R32.1 R33.1 R34.1
Net-(H6-5): H6.5 L3.2 R51.2 R55.1 R56.1
Net-(H6-6): H6.6 L3.1 R43.1 R44.1 R50.1
Net-(H9-1): H9.1 U1.4(PC15-OSC32_OUT)
Net-(H9-2): H9.2 U1.3(PC14-OSC32_IN)
Net-(H9-3): H9.3 U1.2(PC13)
Net-(H11-1): H11.1 U1.36(PF7)
Net-(H11-2): H11.2 U1.35(PF6)
Net-(H12-1): H12.1 U1.33(PA12)
Net-(H12-2): H12.2 U1.32(PA11)

Not connected (* = marked no-connect by the designer): TP6 1; TP7 1; TP8 1; TP9 1; U1 7(NRST)

## Notes on the sheets
sheet 1
- SWD口
sheet 2
- 驱动电路
- 电流限制
- V
- 电
  源
- U
- W
sheet 3
- 单片机定时器
  输出20KHZ PWM
- RC滤波
- 旋转变压器
- 功放桥接
- 旋转变压器解码
